# EAGLE design can-bb (EAGLE 9.6.2)
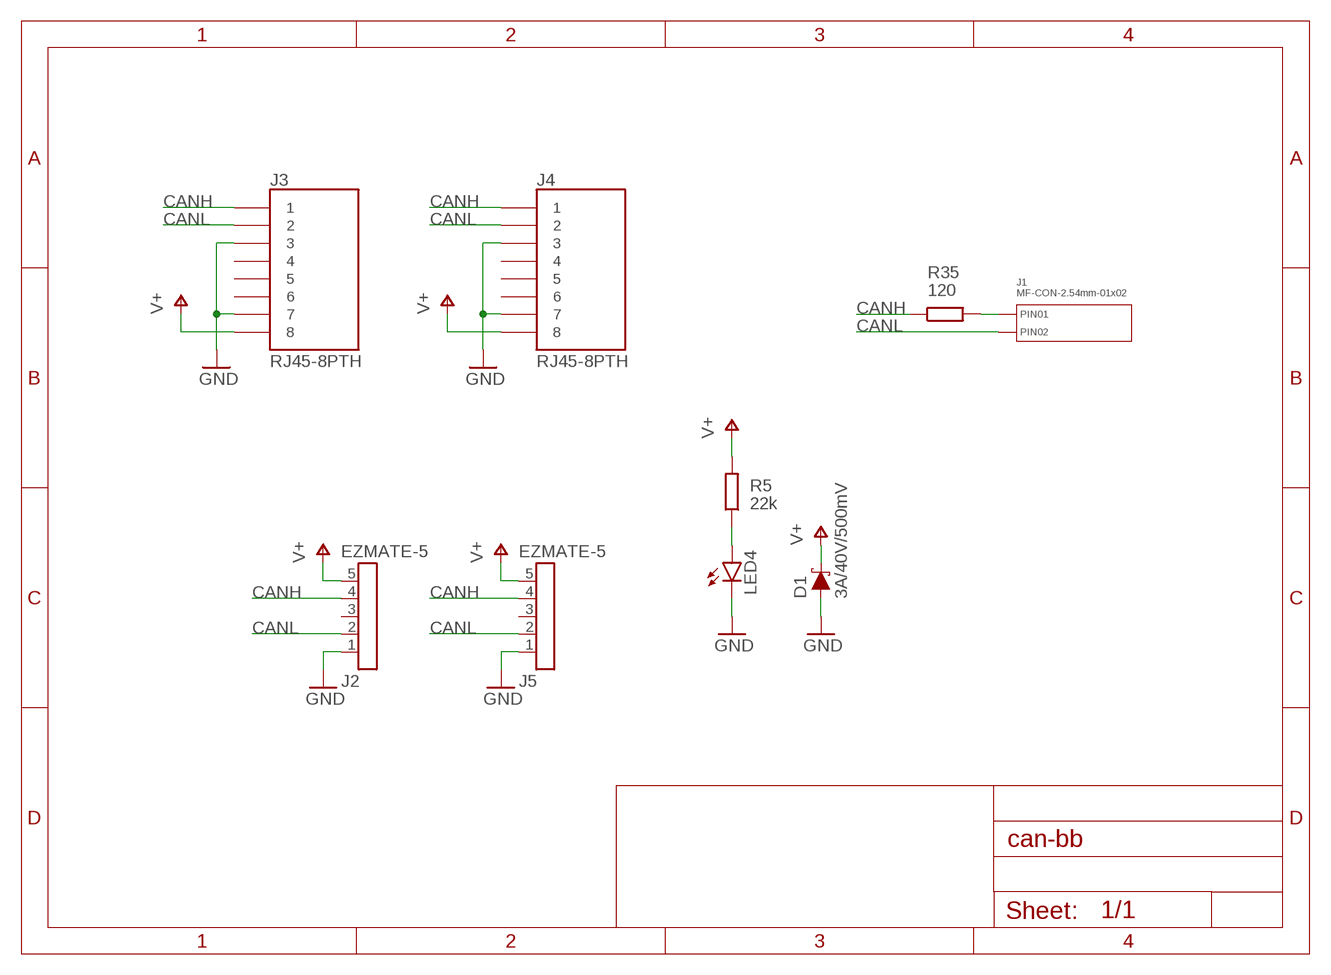
[diagram p0: schematic, sheet 1]

## Parts
D1  3A/40V/500mV  DIODE-SCHOTTKY-B340A  [SMA-DIODE]
J1  MF-CON-2.54mm-01x02  CON_01X02_PTH_2.54MM  [PTH_2.54MM_01X02]
J2  EZMATE-5  [EZMATE-5]
J3  RJ45-8PTH  [RJ45-8]
J4  RJ45-8PTH  [RJ45-8]
J5  EZMATE-5  [EZMATE-5]
LED4  LEDCHIPLED_0603  [CHIPLED_0603]
R5  22k  R0603  [0603]
R35  120  R-EU_R0805  [R0805]

## Nets
CANH: J2.4 J3.1 J4.1 J5.4 R35.1
CANL: J1.P$2(PIN2) J2.2 J3.2 J4.2 J5.2
GND: D1.A J2.1 J3.3 J3.7 J4.3 J4.7 J5.1 LED4.C
N$6: LED4.A R5.1
N$27: J1.P$1(PIN1) R35.2
V+: D1.C J2.5 J3.8 J4.8 J5.5 R5.2
Unconnected: J2.3 J3.4 J3.5 J3.6 J4.4 J4.5 J4.6 J5.3

## Library data of the parts
D1 = SparkFun-DiscreteSemi:DIODE-SCHOTTKY: Schottky diode A Schottky diode is a semiconductor diode which has a low forward voltage drop and a very fast switching action.; PROD_ID: DIO-09886
J1 = MF_Connectors:CON_01X02: Library: MF_Connectors Description: Header Connector with 02 Positions and 01 Rows. Use the LABEL Attribute to label the pin on the schematic and PCB. You can remove the attributes on the PCB by using the SMASH function on the part and then deleting the text.; HOUSEPART: YES; MPN: MF-CON-2.54mm-01x02; POPULATE: 1; URL: https://factory.macrofab.com/part/MF-CON-2.54mm-01x02
J2 J5 = balto:EZMATE-5: Molex Pico-EZMate
J3 J4 = balto:RJ45-8: RJ45 Jack Simple RJ45, 8-pin connection - connector for common Cat5, Cat5e, and Cat6 Ethernet cables. Footprint not yet proven in production. Connector sku is PRT-00643; Breakout PCB sku is BOB-00716.
LED4 = led:LED: LED OSRAM: - CHIPLED LG R971, LG N971, LY N971, LG Q971, LY Q971, LO R971, LY R971 LH N974, LH R974 LS Q976, LO Q976, LY Q976 LO Q996 - Hyper CHIPLED LW Q18S LB Q993, LB Q99A, LB R99A - SideLED LS A670, LO A670, LY A670, LG A670, LP A670 LB A673, LV A673, LT A673, LW A673 LH A674 LY A675 LS A676, LA A676, LO A676, LY A676, LW A676 LS A679, LY A679, LG A679 - Hyper Micro SIDELED® LS Y876, LA Y876, LO Y876, LY Y876 LT Y87S - SmartLED LW L88C, LW L88S LB L89C, LB L89S, LG L890 LS L89K, LO L89K, LY L89K LS L896, LA L896, LO L896, LY L896 - TOPLED LS T670, LO T670, LY T670, LG T670, LP T670 LSG T670, LSP T670, LSY T670, LOP T670, LYG T670 LG T671, LOG T671, LSG T671 LB T673, LV T673, LT T673, LW T673 LH T674 LS T676, LA T676, LO T676, LY T676, LB T676, LH T676, LSB T676, LW T676 LB T67C, LV T67C, LT T67C, LS T67K, LO T67K, LY T67K, LW E67C LS E67B, LA E67B, LO E67B, LY E67B, LB E67C, LV E67C, LT E67C LW T67C LS T679, LY T679, LG T679 LS T770, LO T770, LY T770, LG T770, LP T770 LB T773, LV T773, LT T773, LW T773 LH T774 LS E675, LA E675, LY E675, LS T675 LS T776, LA T776, LO T776, LY T776, LB T776 LHGB T686 LT T68C, LB T68C - Hyper Mini TOPLED® LB M676 - Mini TOPLED Santana® LG M470 LS M47K, LO M47K, LY M47K Source: http://www.osram.convergy.de LUXEON: - LUMILED® LXK2-PW12-R00, LXK2-PW12-S00, LXK2-PW14-U00, LXK2-PW14-V00 LXK2-PM12-R00, LXK2-PM12-S00, LXK2-PM14-U00 LXK2-PE12-Q00, LXK2-PE12-R00, LXK2-PE12-S00, LXK2-PE14-T00, LXK2-PE14-U00 LXK2-PB12-K00, LXK2-PB12-L00, LXK2-PB12-M00, LXK2-PB14-N00, LXK2-PB14-P00, LXK2-PB14-Q00 LXK2-PR12-L00, LXK2-PR12-M00, LXK2-PR14-Q00, LXK2-PR14-R00 LXK2-PD12-Q00, LXK2-PD12-R00, LXK2-PD12-S00 LXK2-PH12-R00, LXK2-PH12-S00 LXK2-PL12-P00, LXK2-PL12-Q00, LXK2-PL12-R00 Source: www.luxeon.com KINGBRIGHT: KA-3528ASYC Source: www.kingbright.com
R5 = balto:R: Resistor
R35 = rcl:R-EU_: RESISTOR, European symbol; SPICEPREFIX: R

## Net classes
0 default: width 0.2 mm

## Board
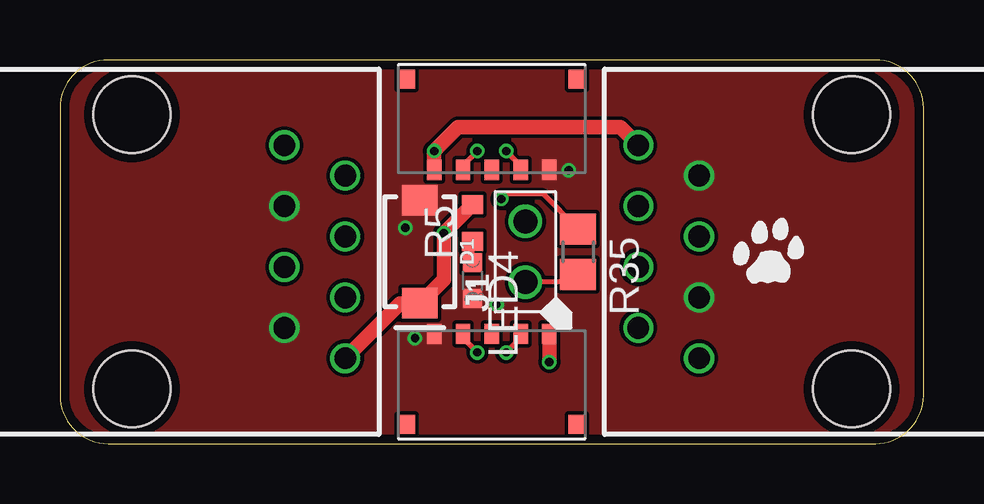
[diagram p1: board, top side]
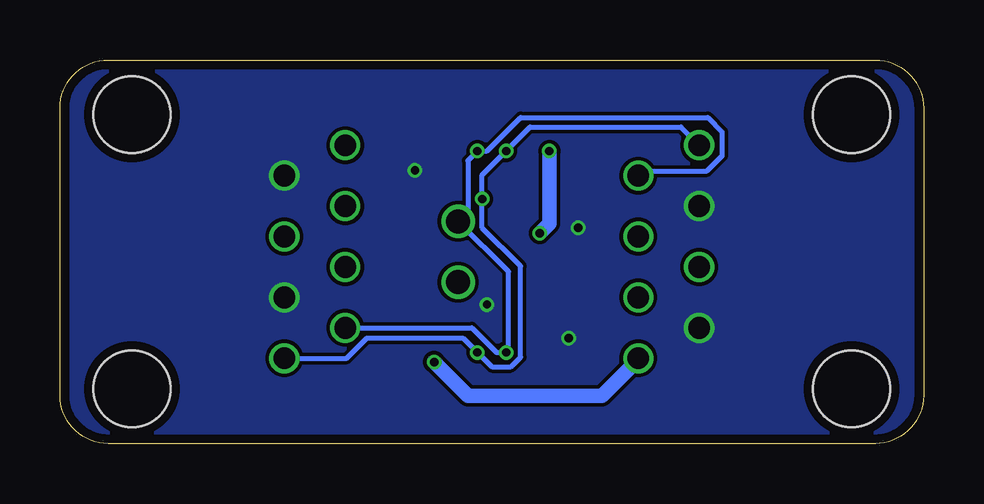
[diagram p2: board, bottom side, seen from below]

Size 36 x 16 mm. Coordinates in mm from the lower left corner, seen from the top.
Outline: 0,14 0,2 arc90 2,0 34,0 arc90 36,2 36,14 arc90 34,16 2,16 arc90 0,14
Copper layers (1+2*15+16): Top 0.0356mm / dielectric 0.1702mm / layer 2 0.0178mm / dielectric 47mil / layer 15 0.0178mm / dielectric 0.1702mm / Bottom 0.0356mm
Design rules "balto *": minimum track width 6mil, minimum drill 10mil, track to track 6mil, track to pad 6mil, pad to pad 6mil, via to via 6mil, smd to smd 6mil, copper to edge 15mil, drill to drill 5mil, minimum pad ring 5mil, minimum via ring 5mil, stop-mask expansion 2mil, vias tented up to drill 20mil, thermal gap 8mil

### Footprints (pad centres in the part's own frame; a part is rotated, then mirrored left to right if it is on the bottom)
SMA-DIODE = smd 1.27 x 1.47: A -2.15,0; C 2.15,0
PTH_2.54MM_01X02 = drill 1: P$1 -1.27,0; P$2 1.27,0
EZMATE-5 = smd 0.6 x 0.85: 1 -2.4,3.775; 2 -1.2,3.775; 3 0,3.775; 4 1.2,3.775; 5 2.4,3.775 | smd 0.7 x 0.8: M1 -3.55,0; M2 3.55,0
RJ45-8 = drill 0.9: 1 -4.445,6.35; 2 -3.175,8.89; 3 -1.905,6.35; 4 -0.635,8.89; 5 0.635,6.35; 6 1.905,8.89; 7 3.175,6.35; 8 4.445,8.89 | hole 3.2: -5.715,0; 5.715,0
CHIPLED_0603 = smd 0.8 x 0.8: A 0,-0.75; C 0,0.75
0603 = smd 0.787 x 0.864: 1 -0.774,0; 2 0.774,0
R0805 = smd 1.3 x 1.5: 1 -0.95,0; 2 0.95,0

### Placement (x,y rotation side)
D1  15,8 270 top
J1  19.4,8 90 top
J2  18,15.2 180 top
J3  3,8 270 top
J4  33,8 90 top
J5  18,0.8 0 top
LED4  17.2,6.8 180 top
R5  17.2,9.2 90 top
R35  21.6,8 270 top
U$1  [CAT-L]  29.6,7.6 0 top

### Tracks (layer width: path | path; a pad name or v marks a point on that pad's centre or on a via)
CANH  (via drill 0.35)
  Top 0.2: R35.1 20.15,10.4 18.6,10.4 v18.4,10.2 | v17.4,12.2 16.8,11.6 J2.4 | v18.6,3.8 19.2,4.4 J5.4
  Bottom 0.2: J4.1 24.05,3.56 23.2,4.4 19.2,4.4 v18.6,3.8 18,3.2 17.2,3.2 16.8,3.6 16.8,7.4 18.4,9 v18.4,10.2 18.4,11.2 v17.4,12.2 16.4,13.2 10.11,13.2 J3.1
CANL  (via drill 0.35)
  Top 0.2: v18.6,12.2 19.2,11.6 J2.2 | J5.2 16.8,4.4 v17.4,3.8
  Bottom 0.2: J4.2 18.82,4.83 17.8,3.8 v17.4,3.8 17.3,3.9 17.3,7.17 J1.P$2 19,9.67 19,11.8 v18.6,12.2 18.2,12.2 16.8,13.6 9,13.6 8.4,13 8.4,12 9.03,11.38 11.69,11.38 J3.2
GND  (via drill 0.35)
  other vias: 14.4,9 14.8,4.4 21.2,11.4 18.2,5.8
  pour Top (no thermals): -1,-1 37,-1 37,17 -1,17
  pour Bottom (no thermals): -2,-2 -2,18 38,18 38,-2
N$6
  Top 0.2: LED4.A R5.1
N$27
  Top 0.2: R35.2 21.28,6.73 J1.P$1
V+  (via drill 0.35)
  Top 0.6: J3.8 14.19,5.85 D1.C 16,6.85 v16,8.77 R5.2 | J2.5 v15.6,12.2 16.6,13.2 23.36,13.2 J4.8 | J5.5 v20.4,3.4
  Bottom 0.6: v15.6,12.2 15.6,9.18 v16,8.77 | v20.4,3.4 19,2 13.4,2 11.89,3.51 J3.8